# Altium project SBC5.PrjPcb (part 6 of 6)

## Sheet Unused.SchDoc
size A; DocumentNumber: 12; SheetNumber: 12; SheetTotal: 13
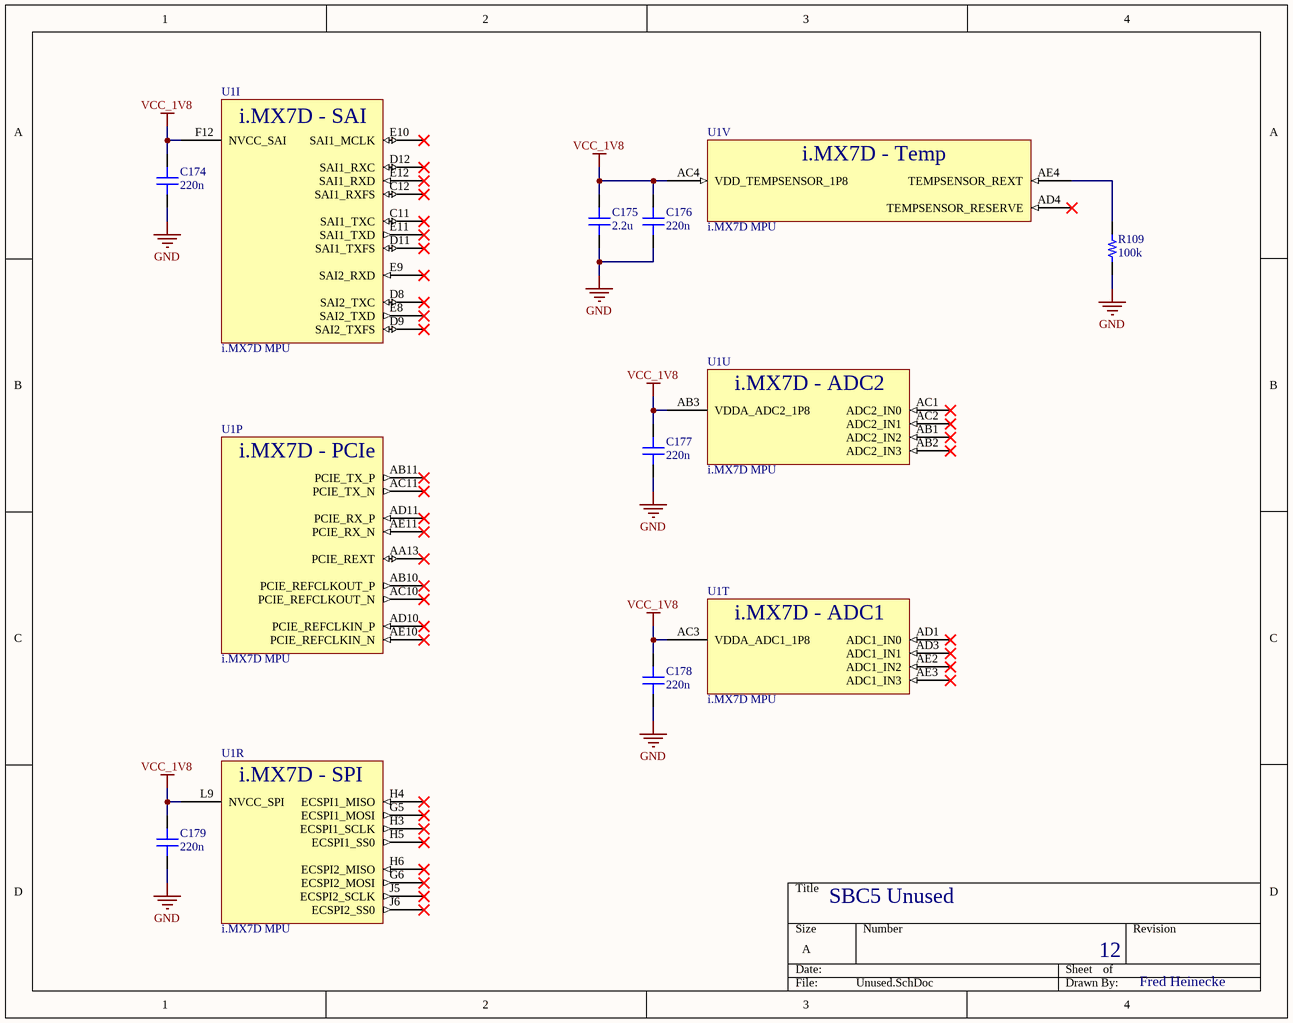
[diagram p14: Unused.SchDoc]

### Parts
C174  220n  [C0201]
C175  2.2u  [C0402]
C176  220n  [C0201]
C177  220n  [C0201]
C178  220n  [C0201]
C179  220n  [C0201]
R109  100k  [R0201]
U1  i.MX7D MPU  [BGA541C75P25X25_1900X1900X140]  (parts I,P,R,T,U,V of 23)

### Nets
GND: C174.1 C175.1 C176.1 C177.1 C178.1 C179.1 R109.1
VCC_1V8: C174.2 C175.2 C176.2 C177.2 C178.2 C179.2 U1.AB3(VDDA_ADC2_1P8) U1.AC3(VDDA_ADC1_1P8) U1.AC4(VDD_TEMPSENSOR_1P8) U1.F12(NVCC_SAI) U1.L9(NVCC_SPI)
NetR109_2: R109.2 U1.AE4(TEMPSENSOR_REXT)

Not connected (* = marked no-connect by the designer): U1 AA13(PCIE_REXT)* AB1(ADC2_IN2)* AB2(ADC2_IN3)* AB10(PCIE_REFCLKOUT_P)* AB11(PCIE_TX_P)* AC1(ADC2_IN0)* AC2(ADC2_IN1)* AC10(PCIE_REFCLKOUT_N)* AC11(PCIE_TX_N)* AD1(ADC1_IN0)* AD3(ADC1_IN1)* AD4(TEMPSENSOR_RESERVE)* AD10(PCIE_REFCLKIN_P)* AD11(PCIE_RX_P)* AE2(ADC1_IN2)* AE3(ADC1_IN3)* AE10(PCIE_REFCLKIN_N)* AE11(PCIE_RX_N)* C11(SAI1_TXC)* C12(SAI1_RXFS)* D8(SAI2_TXC)* D9(SAI2_TXFS)* D11(SAI1_TXFS)* D12(SAI1_RXC)* E8(SAI2_TXD)* E9(SAI2_RXD)* E10(SAI1_MCLK)* E11(SAI1_TXD)* E12(SAI1_RXD)* G5(ECSPI1_MOSI)* G6(ECSPI2_MOSI)* H3(ECSPI1_SCLK)* H4(ECSPI1_MISO)* H5(ECSPI1_SS0)* H6(ECSPI2_MISO)* J5(ECSPI2_SCLK)* J6(ECSPI2_SS0)*

### Notes on the sheet
- SBC5 Unused
- 12
- Fred Heinecke
- (in symbol MCIMX7D2DVM12SD, part I) i.MX7D - SAI
- (in symbol MCIMX7D2DVM12SD, part P) i.MX7D - PCIe
- (in symbol MCIMX7D2DVM12SD, part R) i.MX7D - SPI
- (in symbol MCIMX7D2DVM12SD, part T) i.MX7D - ADC1
- (in symbol MCIMX7D2DVM12SD, part U) i.MX7D - ADC2
- (in symbol MCIMX7D2DVM12SD, part V) i.MX7D - Temp

### Library data of the parts
C174 C176-C179 = GRM033R61C224KE14D: Cap Ceramic Monolithic 0.22uF 16VDC 10% SMD Paper T/R; Manufacturer: Murata; Supplier 1: Digi-Key; Manufacturer Part Number: GRM033R61C224KE14D; RoHS: No; Stock 1: 16192; Pricing 1: 1=0.10000, 10=0.03900, 50=0.02120, 100=0.01720, 500=0.01232, 1000=0.00968, 2500=0.00880, 5000=0.00810 (USD); ComponentLink1URL: https://search.murata.co.jp/Ceramy/image/img/A01X/G101/ENG/GRM033R61C224KE14-01.pdf?src-supplier=Digi-Key; ComponentLink1Description: https://search.murata.co.jp/Ceramy/image/img/A01X/G101/ENG/GRM033R61C224KE14-01.pdf?src-supplier=Digi-Key; Supplier Part Number 1: 490-17040-1-ND
C175 = LMK105BJ225MV-F: TAIYO YUDEN         LMK105BJ225MV-F            CERAMIC CAPACITOR, 2.2UF, 10V, X5R, 20%, 0402; Supplier 1: Digi-Key; Manufacturer: Taiyo Yuden; Manufacturer Part Number: LMK105BJ225MV-F; RoHS: Yes; Category: Ceramic Capacitors; Stock 1: 422093; Pricing 1: 1=0.10000, 10=0.05800, 50=0.03160, 100=0.02590, 500=0.01848, 1000=0.01452, 2500=0.01320, 5000=0.01214 (USD); Mount: Surface Mount; Case/Package: 0402; Case Code (Imperial): 0402; Case Code (Metric): 1005; Min Operating Temperature: -55°C; Max Operating Temperature: 85°C; Termination: SMD/SMT; Packaging: Tape and Reel; Capacitance: 2.2uF; Tolerance: 20%; Voltage Rating: 10V; Package Quantity: 1; Voltage Rating (DC): 10V; Dielectric: X5R; Resistor Type: Ceramic; Length: 1mm; Width: 0.5mm; Height: 0.5mm; Thickness: 0.022inch; Depth: 0.5mm; Radiation Hardening: No; Halogen Free: Halogen Free; REACH SVHC: Unknown; ComponentLink1URL: https://datasheet.ciiva.com/30190/500lmk105bj225mv-f-30190498.pdf?src-supplier=Onlinecomponents.com; ComponentLink1Description: https://datasheet.ciiva.com/30190/500lmk105bj225mv-f-30190498.pdf?src-supplier=Onlinecomponents.com; ComponentLink2URL: https://datasheet.ciiva.com/23631/lmk105bj225mv-f-ss-23631491.pdf?src-supplier=Newark; ComponentLink2Description: https://datasheet.ciiva.com/23631/lmk105bj225mv-f-ss-23631491.pdf?src-supplier=Newark; ComponentLink3URL: https://datasheet.ciiva.com/134/lmk105bj225mv-f-ss-134677.pdf?src-supplier=Digi-Key; ComponentLink3Description: https://datasheet.ciiva.com/134/lmk105bj225mv-f-ss-134677.pdf?src-supplier=Digi-Key; ComponentLink4URL: https://datasheet.ciiva.com/15921/286lmk105bj225mv-f-15921222.pdf?src-supplier=Onlinecomponents.com; ComponentLink4Description: https://datasheet.ciiva.com/15921/286lmk105bj225mv-f-15921222.pdf?src-supplier=Onlinecomponents.com; Supplier Part Number 1: 587-3153-1-ND
R109 = ERJ-1GNF1003C: PANASONIC - ERJ1GNF1003C - RES, 100K, 1%, 0.05W, 0201, THICK FILM; Resistance: 100kR; Temperature Coefficient: 200ppm/°C; Power Rating: 50mW; Voltage Rating: 25V; Supplier 1: Digi-Key; Supplier Part Number 1: P122655CT-ND; Manufacturer: Panasonic; Manufacturer Part Number: ERJ-1GNF1003C; RoHS: Yes; Category: Chip SMD Resistors; Stock 1: 833904; Pricing 1: 1=0.10000, 10=0.04600, 100=0.01890, 1000=0.00848, 2500=0.00736, 5000=0.00608 (USD); Mount: Surface Mount; Case/Package: 0201; Number of Pins: 2; Contact Plating: Tin,Matte; Case Code (Metric): 0603; Case Code (Imperial): 0201; Weight: 6E-06oz; Size Code: 0201; Min Operating Temperature: -55°C; Max Operating Temperature: 125°C; Tolerance: 1%; Resistor Type: Thick Film; Packaging: Tape and Reel; Package Quantity: 15000; Number of Terminations: 2; Max Power Dissipation: 50mW; Termination: SMD/SMT; Voltage Rating (DC): 25V; Series: ERJ; Resistance Tolerance: 1%; Length: 0.024inch; Width: 0.012inch; Height: 0.01inch; Radiation Hardening: No; REACH SVHC: No SVHC; Lead Free: Lead Free; RoHS Compliant: Yes; ComponentLink1URL: https://datasheet.ciiva.com/7830/1678782-7830709.pdf?src-supplier=Element14; ComponentLink1Description: https://datasheet.ciiva.com/7830/1678782-7830709.pdf?src-supplier=Element14; ComponentLink2URL: https://datasheet.ciiva.com/16508/aoa0000ce2-16508328.pdf?src-supplier=Future+Electronics; ComponentLink2Description: https://datasheet.ciiva.com/16508/aoa0000ce2-16508328.pdf?src-supplier=Future+Electronics; ComponentLink3URL: https://datasheet.ciiva.com/24161/aoa0000ce2-24161032.pdf?src-supplier=Mouser; ComponentLink3Description: https://datasheet.ciiva.com/24161/aoa0000ce2-24161032.pdf?src-supplier=Mouser; ComponentLink4URL: https://datasheet.ciiva.com/43467/1678782-43467102.pdf?src-supplier=Farnell; ComponentLink4Description: https://datasheet.ciiva.com/43467/1678782-43467102.pdf?src-supplier=Farnell
U1 = MCIMX7D2DVM12SD: as U1 on sheet CPU Power; Manufacturer Part Number: MCIMX7D2DVM12SD; Stock 1: 0; Pricing 1: 168=18.42238 (USD); ComponentLink1Description: Datasheet; ComponentLink1URL: https://www.nxp.com/docs/en/data-sheet/IMX7DCEC.pdf; ComponentLink2Description: Reference manual; ComponentLink2URL: https://www.nxp.com/docs/en/reference-manual/IMX7DRM.pdf; ComponentLink3Description: Hardware Development Guide; ComponentLink3URL: https://www.nxp.com/docs/en/user-guide/IMX7DSHDG.pdf; Supplier 1: Digi-Key; Supplier Part Number 1: 568-15401-ND

## Sheet GPIO.SchDoc
size A; DocumentNumber: 13; SheetNumber: 13; SheetTotal: 13
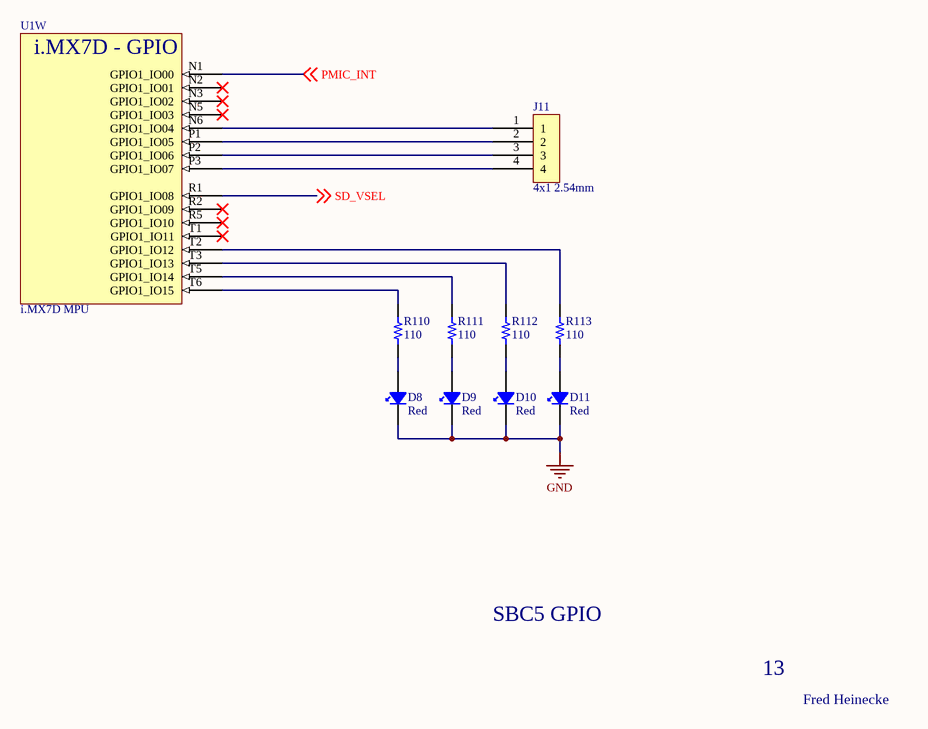
[diagram p15: GPIO.SchDoc]

### Parts
D8  Red  [D0603]
D9  Red  [D0603]
D10  Red  [D0603]
D11  Red  [D0603]
J11  4x1 2.54mm  [PH1-04-UA]
R110  110  [R0402]
R111  110  [R0402]
R112  110  [R0402]
R113  110  [R0402]
U1  i.MX7D MPU  [BGA541C75P25X25_1900X1900X140]  (part W of 23)

### Nets
GND: D8.K D9.K D10.K D11.K
PMIC_INT: U1.N1(GPIO1_IO00) ; off-sheet PMIC_INT
SD_VSEL: U1.R1(GPIO1_IO08) ; off-sheet SD_VSEL
NetD8_A: D8.A R110.1
NetD9_A: D9.A R111.1
NetD10_A: D10.A R112.1
NetD11_A: D11.A R113.1
NetJ11_1: J11.1 U1.N6(GPIO1_IO04)
NetJ11_2: J11.2 U1.P1(GPIO1_IO05)
NetJ11_3: J11.3 U1.P2(GPIO1_IO06)
NetJ11_4: J11.4 U1.P3(GPIO1_IO07)
NetR110_2: R110.2 U1.T6(GPIO1_IO15)
NetR111_2: R111.2 U1.T5(GPIO1_IO14)
NetR112_2: R112.2 U1.T3(GPIO1_IO13)
NetR113_2: R113.2 U1.T2(GPIO1_IO12)

Not connected (* = marked no-connect by the designer): U1 N2(GPIO1_IO01)* N3(GPIO1_IO02)* N5(GPIO1_IO03)* R2(GPIO1_IO09)* R5(GPIO1_IO10)* T1(GPIO1_IO11)*

### Notes on the sheet
- SBC5 GPIO
- 13
- Fred Heinecke
- (in symbol MCIMX7D2DVM12SD, part W) i.MX7D - GPIO

### Library data of the parts
D8-D11 = 150060RS75000: WURTH ELEKTRONIK - 150060RS75000 - LED, Red, 625 nm, 2 V, 30 mA, 250 mcd RoHS Compliant: Yes; Manufacturer: Wurth Electronics; Viewing Angle: 140°; Lens Style: Clear,Rectangular; Luminous Intensity: 250mcd; Forward Current: 30mA; Forward Voltage: 2V; Wavelength: 625nm; Test Current: 20mA; Supplier 1: Digi-Key; Supplier Part Number 1: 732-4978-1-ND; Manufacturer Part Number: 150060RS75000; RoHS: Yes; Category: LEDs; Stock 1: 175802; Pricing 1: 1=0.14000, 50=0.13300, 100=0.11400, 500=0.09990 (USD); Mount: Surface Mount; Case/Package: 0603; Color: Red; Case Code (Metric): 1608; Case Code (Imperial): 0603; Min Operating Temperature: -40°C; Max Operating Temperature: 85°C; Package Quantity: 1; Packaging: Cut Tape; Dominant Wavelength: 625nm; Length: 1.6mm; Width: 0.8mm; Height: 0.7mm; REACH SVHC: Unknown; RoHS Compliant: Yes; ComponentLink1URL: https://datasheet.ciiva.com/29563/150060rs75000-29563040.pdf?src-supplier=Digi-Key; ComponentLink1Description: https://datasheet.ciiva.com/29563/150060rs75000-29563040.pdf?src-supplier=Digi-Key; ComponentLink2URL: https://datasheet.ciiva.com/29279/759428-da-01-en-chipled-0603-w-kl-rot-150060rs75000-29279196.pdf?src-supplier=Conrad; ComponentLink2Description: https://datasheet.ciiva.com/29279/759428-da-01-en-chipled-0603-w-kl-rot-150060rs75000-29279196.pdf?src-supplier=Conrad
J11 = PH1-04-UA: Conn Unshrouded Header HDR 4 POS 2.54mm Solder ST Thru-Hole Bag; Manufacturer: Adam Equipment; Number of Positions: 4; Supplier 1: Digi-Key; Supplier Part Number 1: 2057-PH1-04-UA-ND; Manufacturer Part Number: PH1-04-UA; RoHS: Yes; Category: Connectors; Stock 1: 1152; Pricing 1: 1=0.10000, 10=0.07200, 100=0.04440, 500=0.03672, 1000=0.03213, 5000=0.02754, 10000=0.02678 (USD); Termination: Through Hole; Pitch: 2.54mm; Lead Free: Lead Free; ComponentLink1URL: http://www.adam-tech.com/catalog/2010/page_292-295.pdf?src-supplier=Future+Electronics; ComponentLink1Description: http://www.adam-tech.com/catalog/2010/page_292-295.pdf?src-supplier=Future+Electronics; ComponentLink2Description: Datasheet; ComponentLink2URL: https://static6.arrow.com/aropdfconversion/683efa088b5c0b1a8da3df70e12f05ed3743b8bf/page_292.pdf; ComponentLink3Description: Mechanical drawing; ComponentLink3URL: http://www.adam-tech.com/upload/PH1-XX-UA.pdf
R110-R113 = RMCF0402FT110R: Res Thick Film 0402 110 Ohm 1% 0.063W(1/16W) ±100ppm/C Pad SMD Automotive T/R; Manufacturer: Stackpole Electronics; Resistance: 110R; Max Power Dissipation: 63mW; Temperature Coefficient: 100ppm/°C; Supplier 1: Digi-Key; Supplier Part Number 1: RMCF0402FT110RCT-ND; Manufacturer Part Number: RMCF0402FT110R; RoHS: Yes; Category: Chip SMD Resistors; Stock 1: 98158; Pricing 1: 1=0.10000, 10=0.01300, 100=0.00530, 1000=0.00239, 2500=0.00207, 5000=0.00171 (USD); Mount: Surface Mount; Case/Package: 0402; Case Code (Metric): 1005; Case Code (Imperial): 0402; Contact Plating: Tin,Matte; Min Operating Temperature: -55°C; Max Operating Temperature: 155°C; Packaging: Tape and Reel; Tolerance: 1%; Package Quantity: 1; Resistor Type: Thick Film; Number of Terminations: 2; Features: Automotive AEC-Q200; Series: RMCF; Length: 0.039inch; Width: 0.02inch; Height: 0.016inch; Lead Free: Lead Free; RoHS Compliant: Yes; ComponentLink1URL: https://www.seielect.com/Catalog/SEI-RMCF_RMCP.pdf?src-supplier=Avnet; ComponentLink1Description: https://www.seielect.com/Catalog/SEI-RMCF_RMCP.pdf?src-supplier=Avnet; ComponentLink2URL: https://www.seielect.com/Catalog/SEI-RMCF_RMCP.pdf?src-supplier=Digi-Key; ComponentLink2Description: https://www.seielect.com/Catalog/SEI-RMCF_RMCP.pdf?src-supplier=Digi-Key; ComponentLink3URL: https://www.seielect.com/catalog/SEI-Packaging.pdf?src-supplier=Digi-Key; ComponentLink3Description: https://www.seielect.com/catalog/SEI-Packaging.pdf?src-supplier=Digi-Key
U1 = MCIMX7D2DVM12SD: Heterogeneous Multicore Processing Architecture; Manufacturer: NXP Freescale; Manufacturer Part Number: MCIMX7D2DVM12SD; Stock 1: 0; Pricing 1: 168=18.42238 (USD); ComponentLink1Description: Datasheet; ComponentLink1URL: https://www.nxp.com/docs/en/data-sheet/IMX7DCEC.pdf; ComponentLink2Description: Reference manual; ComponentLink2URL: https://www.nxp.com/docs/en/reference-manual/IMX7DRM.pdf; ComponentLink3Description: Hardware Development Guide; ComponentLink3URL: https://www.nxp.com/docs/en/user-guide/IMX7DSHDG.pdf; Supplier 1: Digi-Key; Supplier Part Number 1: 568-15401-ND

## Nets that join several sheets
3V3: Power Conversion (5 pins), MIPI (7 pins)
3V7: Power Conversion (5 pins), PMIC (24 pins)
5V0: Power Conversion (5 pins), USB (9 pins)
CHS_GND: Power Conversion (J1.S1 J1.S2), USB (J5.S1 J5.S2 J5.S3 J5.S4), SD (J6.SHIELD1 J6.SHIELD2 J6.SHIELD3 J6.SHIELD4), Ethernet (J7.8 J7.13 J7.14 R79.1)
DDR_VREF: PMIC (R26.2), DDR3L (10 pins)
GND: Power Conversion (29 pins), PMIC (47 pins), CPU Power (182 pins), DDR3L (90 pins), Control (20 pins), USB (21 pins), SD (8 pins), Ethernet (15 pins), MIPI (13 pins), I2C and UART (C167.1 C168.1 C169.1), LCD (C170.1 C171.1 C172.1 C173.1), Unused (7 pins), GPIO (D8.K D9.K D10.K D11.K)
NVCC_3V3: PMIC (C84.2 R25.2 U4.47), USB (8 pins), SD (C150.2 C151.2 U1.H8 U1.K8), Ethernet (13 pins), I2C and UART (10 pins), LCD (C170.2 C171.2 U1.L17 U1.M18)
NVCC_DRAM: PMIC (C58.2 C62.2 R21.2 U4.24), DDR3L (83 pins)
PVCC_ENET_CAP: SD (R59.2), Ethernet (C162.2 U1.H14)
VCC_1V8: PMIC (R19.2), CPU Power (FB1.1 R3.2), LCD (22 pins), Unused (11 pins)
VCC_3V3_LP: PMIC (R16.2 R17.2), CPU Power (C37.2 U1.P8 U1.T8), Control (R35.2 R36.2 R38.2 R47.2)
VCC_ARM: PMIC (R14.2), CPU Power (14 pins)
VCC_SD: PMIC (R24.2), SD (6 pins)
VCC_SOC: PMIC (R18.2), CPU Power (34 pins)
VDD_LPSR: PMIC (R13.2), CPU Power (C35.2 U1.W6)
VDDA_1P8: CPU Power (5 pins), Control (C127.2 U1.V5)
VSNVS: PMIC (R15.2 R22.2), CPU Power (C33.2 U1.AD8), Control (R46.2)
CSI_LED: MIPI (J9.12), LCD (U1.P21)
CSI_POWER_EN: MIPI (J9.11), LCD (U1.P20)
ENET1_MDC: SD (U1.C3), Ethernet (U8.13)
ENET1_MDIO: SD (U1.D3), Ethernet (R64.1 U8.12)
I2C_CSI_SCL: MIPI (J9.13), I2C and UART (R85.1 U1.K2)
I2C_CSI_SDA: MIPI (J9.14), I2C and UART (R86.1 U1.K3)
I2C_DSI_SCL: MIPI (J8.11), I2C and UART (R87.1 U1.K5)
I2C_DSI_SDA: MIPI (J8.12), I2C and UART (R88.1 U1.K6)
I2C_PMIC_SCL: PMIC (U4.46), I2C and UART (R83.1 U1.J2)
I2C_PMIC_SDA: PMIC (U4.45), I2C and UART (R84.1 U1.K1)
PMIC_INT: PMIC (R16.1 U4.1), GPIO (U1.N1)
PMIC_ON_REQ: PMIC (R15.1 U4.48), Control (U1.AB8)
PMIC_RESET: PMIC (U4.3), Control (R49.1)
PMIC_STBY_REQ: PMIC (U4.4), Control (U1.AC7)
SD_VSEL: PMIC (R23.2 U4.2), GPIO (U1.R1)
USB_1_OC: USB (R54.1 U7.8), I2C and UART (U1.M1)
USB_2_OC: USB (R55.1 U7.5), I2C and UART (U1.M5)

## Assembly variants
DNP depopulated: not fitted C128 C129 R29 R30 R41 R42 R44 R89 R90 R91 R92 R93 R94 R95 R96 R97 R98 R99 R100 R102 R103 R104 R105 R106 R107 R108